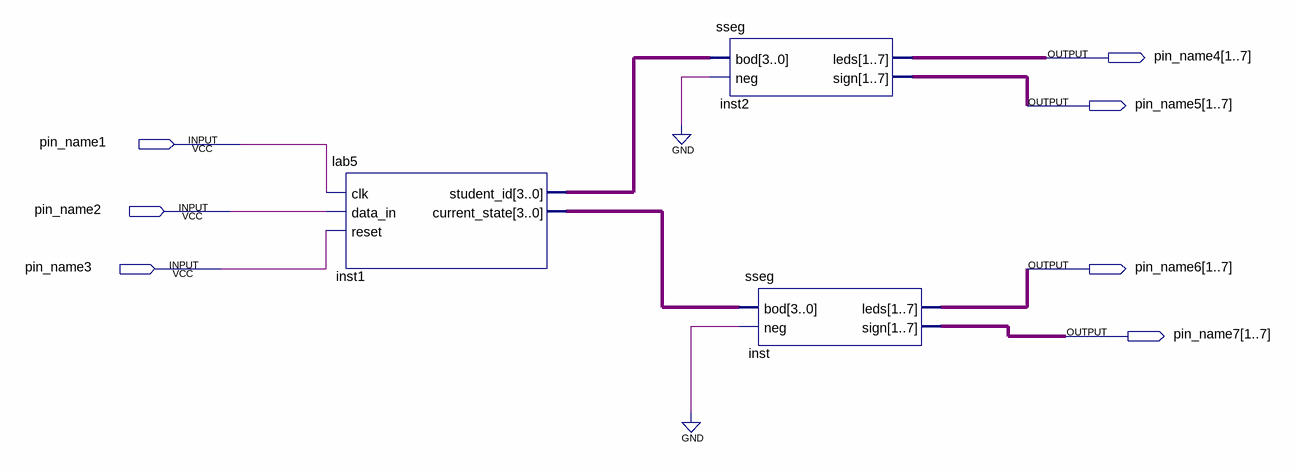
[diagram p0: schematic sheet]
// Quartus schematic Block2.bdf as structural Verilog: 3 symbols, 7 pins
module Block2 (
  input  pin_name1,
  input  pin_name2,
  input  pin_name3,
  output [1:7] pin_name4,
  output [1:7] pin_name5,
  output [1:7] pin_name6,
  output [1:7] pin_name7
);

  wire [3:0] inst1_current_state, inst1_student_id;

  lab5 inst1 (
    .clk(pin_name1), .data_in(pin_name2), .reset(pin_name3), .student_id(inst1_student_id),
    .current_state(inst1_current_state));
  sseg inst2 (.bod(inst1_student_id), .neg(1'b0), .leds(pin_name4), .sign(pin_name5));
  sseg inst (.bod(inst1_current_state), .neg(1'b0), .leds(pin_name6), .sign(pin_name7));
endmodule
